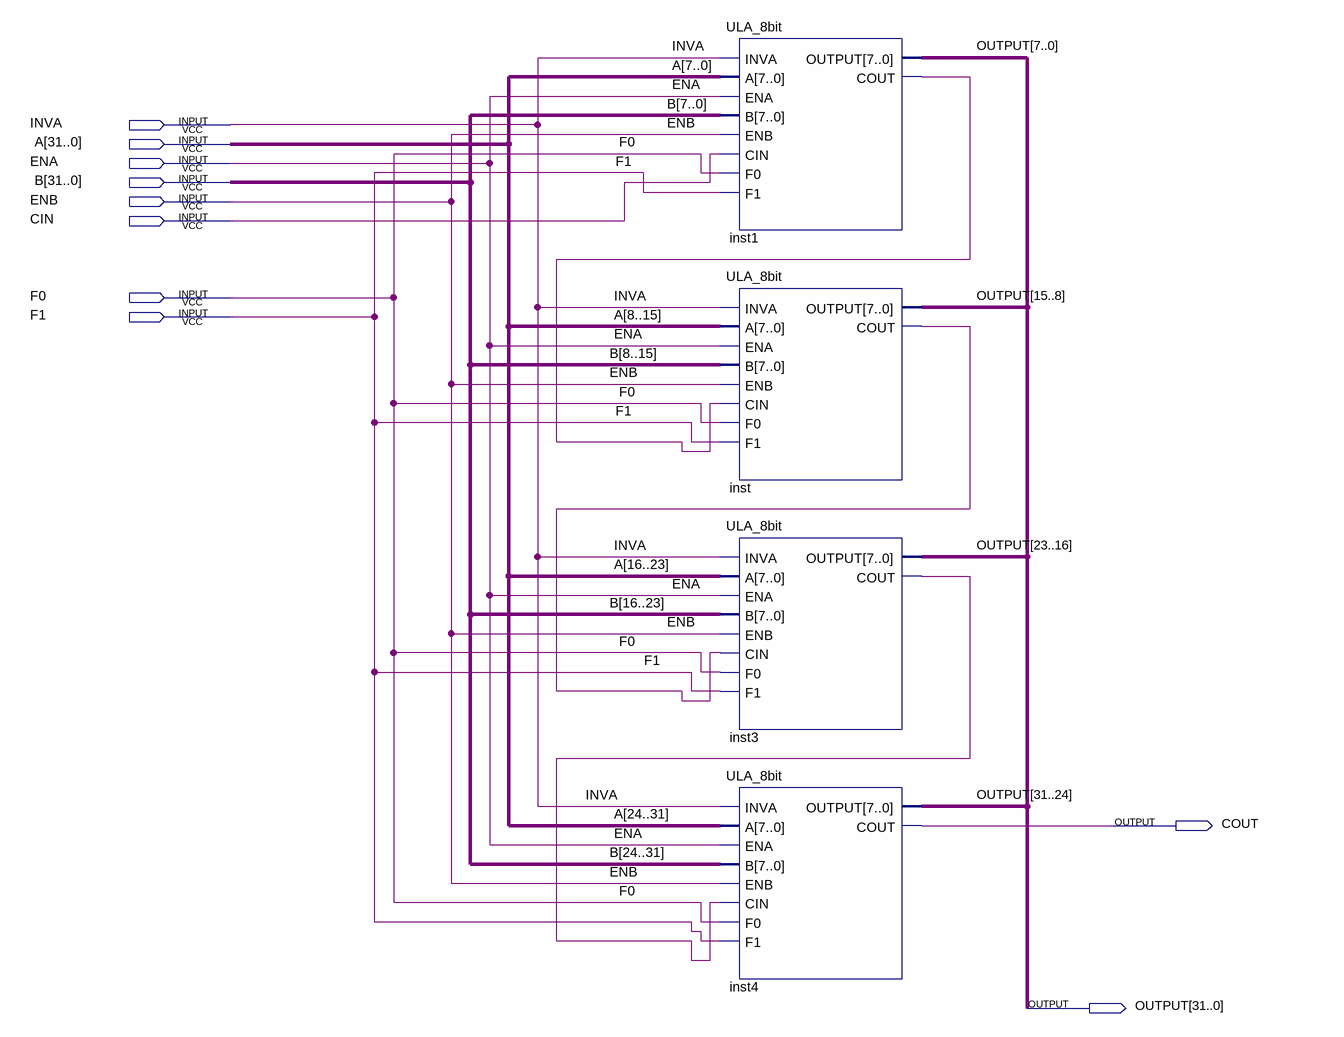
[diagram p0: schematic sheet]
// Quartus schematic ULA_32bit.bdf as structural Verilog: 4 symbols, 10 pins
module ULA_32bit (
  input  INVA,
  input  [31:0] A,
  input  ENA,
  input  [31:0] B,
  input  ENB,
  input  CIN,
  input  F0,
  input  F1,
  output COUT,
  output [31:0] OUTPUT
);

  wire inst1_cout, inst3_cout, inst_cout;

  ULA_8bit inst1 (
    .INVA(INVA), .A(A[7:0]), .ENA(ENA), .B(B[7:0]), .ENB(ENB), .CIN(CIN), .F0(F0), .F1(F1),
    .OUTPUT(OUTPUT[7:0]), .COUT(inst1_cout));
  ULA_8bit inst (
    .INVA(INVA), .A({A[8], A[9], A[10], A[11], A[12], A[13], A[14], A[15]}), .ENA(ENA),
    .B({B[8], B[9], B[10], B[11], B[12], B[13], B[14], B[15]}), .ENB(ENB), .CIN(inst1_cout), .F0(F0),
    .F1(F1), .OUTPUT(OUTPUT[15:8]), .COUT(inst_cout));
  ULA_8bit inst3 (
    .INVA(INVA), .A({A[16], A[17], A[18], A[19], A[20], A[21], A[22], A[23]}), .ENA(ENA),
    .B({B[16], B[17], B[18], B[19], B[20], B[21], B[22], B[23]}), .ENB(ENB), .CIN(inst_cout), .F0(F0),
    .F1(F1), .OUTPUT(OUTPUT[23:16]), .COUT(inst3_cout));
  ULA_8bit inst4 (
    .INVA(INVA), .A({A[24], A[25], A[26], A[27], A[28], A[29], A[30], A[31]}), .ENA(ENA),
    .B({B[24], B[25], B[26], B[27], B[28], B[29], B[30], B[31]}), .ENB(ENB), .CIN(inst3_cout), .F0(F0),
    .F1(F1), .OUTPUT(OUTPUT[31:24]), .COUT(COUT));
endmodule
